# EAGLE design donkey_header (EAGLE 4.16)
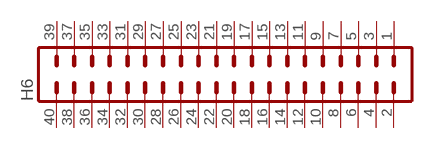
[diagram p0: schematic, sheet 1]

## Parts
H6  MA20-2_SHROUD  [MA20X2]
Unconnected: H6.1 H6.2 H6.3 H6.4 H6.5 H6.6 H6.7 H6.8 H6.9 H6.10 H6.11 H6.12 H6.13 H6.14 H6.15 H6.16 H6.17 H6.18 H6.19 H6.20 H6.21 H6.22 H6.23 H6.24 H6.25 H6.26 H6.27 H6.28 H6.29 H6.30 H6.31 H6.32 H6.33 H6.34 H6.35 H6.36 H6.37 H6.38 H6.39 H6.40

## Library data of the parts
H6 = 2_ronlib:MA20-2_SHROUD

## Net classes
1 VCC: width 0.508 mm
2 GND: width 1.016 mm

## Board
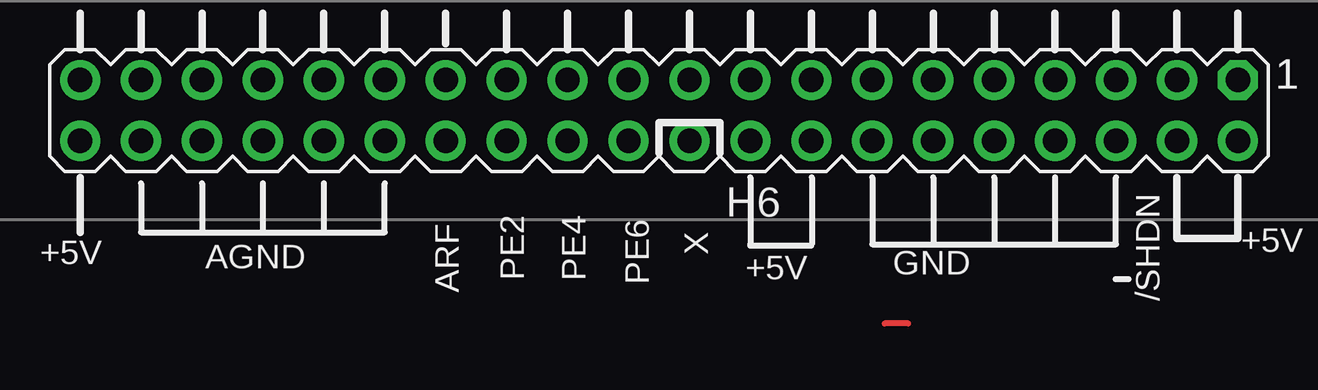
[diagram p1: board, top side]

No outline drawn. Coordinates in mm, seen from the top.
Copper layers (1*16): Top 0.035mm / dielectric 1.5mm / Bottom 0.035mm
Design rules "default": minimum track width 10mil, minimum drill 24mil, track to track 10mil, track to pad 10mil, pad to pad 10mil, via to via 10mil, smd to smd 8mil, copper to edge 10mil, drill to drill 15mil, minimum pad ring 10mil, minimum via ring 8mil, stop-mask expansion 2.5mil, vias tented up to drill 0mil, thermal gap 10mil
vRestrict: area 37.2,26.8 to 38.8,29.6; area 34.7,26.2 to 36.4,29.7; area 39.9,26.9 to 41.2,29.6; area 41.9,26.9 to 43.4,29.6; area 45.2,27.9 to 46.8,29.6; area 47.9,27.1 to 51.1,28.3

### Footprints (pad centres in the part's own frame; a part is rotated, then mirrored left to right if it is on the bottom)
MA20X2 = drill 1.016 pad 1.676 octagon: 1 -24.13,-1.27 | drill 1.016 pad 1.676 round: 2 -24.13,1.27; 3 -21.59,-1.27; 4 -21.59,1.27; 5 -19.05,-1.27; 6 -19.05,1.27; 7 -16.51,-1.27; 8 -16.51,1.27; 9 -13.97,-1.27; 10 -13.97,1.27; 11 -11.43,-1.27; 12 -11.43,1.27; 13 -8.89,-1.27; 14 -8.89,1.27; 15 -6.35,-1.27; 16 -6.35,1.27; 17 -3.81,-1.27; 18 -3.81,1.27; 19 -1.27,-1.27; 20 -1.27,1.27; 21 1.27,-1.27; 22 1.27,1.27; 23 3.81,-1.27; 24 3.81,1.27; 25 6.35,-1.27; 26 6.35,1.27; 27 8.89,-1.27; 28 8.89,1.27; 29 11.43,-1.27; 30 11.43,1.27; 31 13.97,-1.27; 32 13.97,1.27; 33 16.51,-1.27; 34 16.51,1.27; 35 19.05,-1.27; 36 19.05,1.27; 37 21.59,-1.27; 38 21.59,1.27; 39 24.13,-1.27; 40 24.13,1.27

### Placement (x,y rotation side)
H6  44.45,34.29 180 top

### Tracks (layer width: path | path; a pad name or v marks a point on that pad's centre or on a via)
N$337
  Top 0.254: 54.84,25.4 53.85,25.4

### Text on the board
tPlace: PF7 | PF6 | PF5 | PF4 | PF1 | PF0 | AVCC | PE3 | PE5 | PE7 | PB0 | PB1 | PB2 | PB3 | PB4 | PB5 | PB6 | PB7 | ARF | +5V | AGND | +5V | X | GND | PE2 | PE4 | PE6 | +5V | /SHDN